# Altium schematic sheet iNixie-Kit.schdoc
size 708 x 327 mm; Name: A_A3; Symbol: A_A3; Device: A_A3; @Project Name: Action时钟_bak; REV: 1.0; Date: 2022-06-21; Sheet: 1/1; Draw By: Sadudu; Company: Your Company; Convert to PCB: yes; Add into BOM: yes
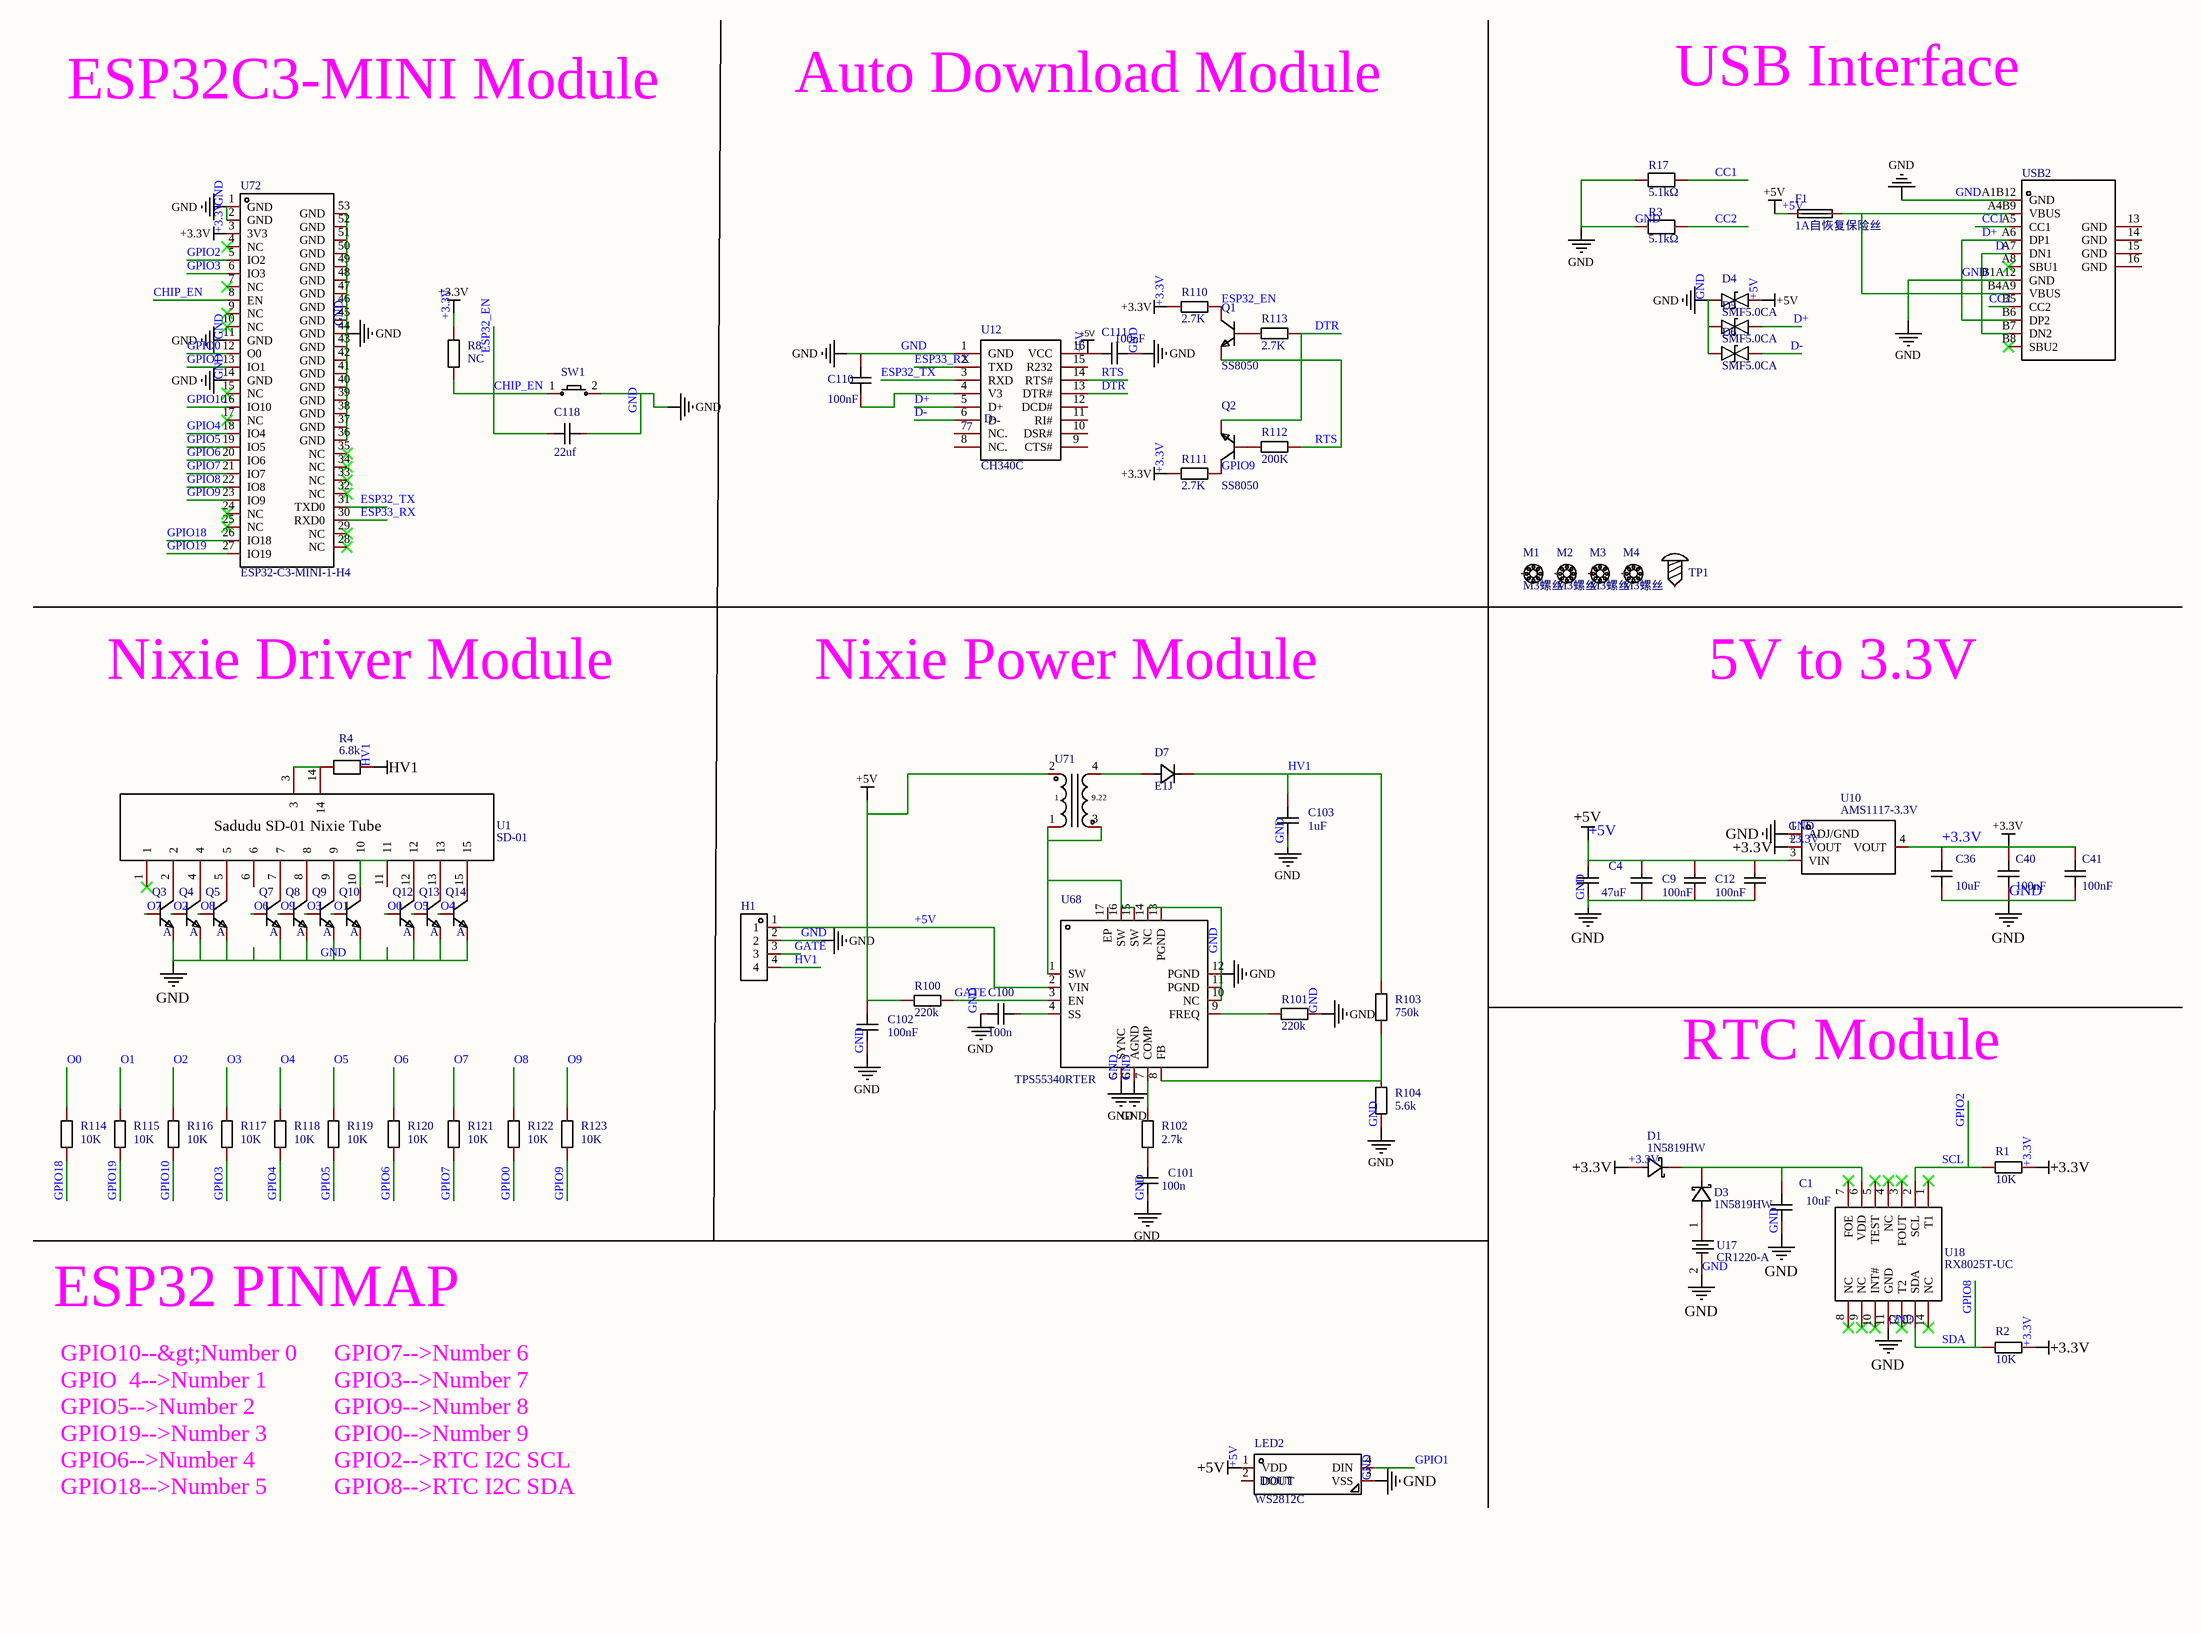
[diagram p0: iNixie-Kit.schdoc]

## Parts
C1  value 10uF  [C0603]  (hidden comment: CL10A106MP8NNNC)
C4  47uF  [C1206]
C9  value 100nF  [C0603]  (hidden comment: 0603B104K500NT)
C12  value 100nF  [C0603]  (hidden comment: 0603B104K500NT)
C13  0603B104K500NT  [C0603]  (value not drawn)
C36  value 10uF  [C0603]  (hidden comment: CL10A106MP8NNNC)
C40  100nF  [C0402]
C41  100nF  [C0402]
C100  100n  [C0402]
C101  100n  [C0402]
C102  100nF  [C0603]
C103  1uF  [C1206]
C110  100nF  [C0603]
C111  100nF  [C0603]
C118  22uf  [C0402]
D1  1N5819HW  [SOD-123_L2.7-W1.6-LS3.7-RD-1]
D3  1N5819HW  [SOD-123_L2.7-W1.6-LS3.7-RD-1]
D4  SMF5.0CA  [SOD-123_L2.8-W1.8-LS3.7-BI]
D5  SMF5.0CA  [SOD-123_L2.8-W1.8-LS3.7-BI]
D6  SMF5.0CA  [SOD-123_L2.8-W1.8-LS3.7-BI]
D7  E1J  [SOD-123FL_L2.7-W1.8-LS3.7-RD]
F1  1A自恢复保险丝  [F1812]
H1  HDR-M_2.54_1x4P  [HDR-TH_4P-P2.54-V-M]  (value not drawn)
LED2  NAME: DOUT  [LED-SMD_4P-L5.0-W5.0-LS5.4-TL-1]  (hidden comment: WS2812C)
M1  M3螺丝  [螺钉孔]
M2  M3螺丝  [螺钉孔]
M3  M3螺丝  [螺钉孔]
M4  M3螺丝  [螺钉孔]
Q1  SS8050  [SOT-23-3_L2.9-W1.3-P1.90-LS2.4-BR]
Q2  SS8050  [SOT-23-3_L2.9-W1.3-P1.90-LS2.4-BR]
Q3  A  [SOT-23-3_L2.9-W1.6-P1.90-LS2.8-TR-CW]
Q4  A  [SOT-23-3_L2.9-W1.6-P1.90-LS2.8-TR-CW]
Q5  A  [SOT-23-3_L2.9-W1.6-P1.90-LS2.8-TR-CW]
Q7  A  [SOT-23-3_L2.9-W1.6-P1.90-LS2.8-TR-CW]
Q8  A  [SOT-23-3_L2.9-W1.6-P1.90-LS2.8-TR-CW]
Q9  A  [SOT-23-3_L2.9-W1.6-P1.90-LS2.8-TR-CW]
Q10  A  [SOT-23-3_L2.9-W1.6-P1.90-LS2.8-TR-CW]
Q12  A  [SOT-23-3_L2.9-W1.6-P1.90-LS2.8-TR-CW]
Q13  A  [SOT-23-3_L2.9-W1.6-P1.90-LS2.8-TR-CW]
Q14  A  [SOT-23-3_L2.9-W1.6-P1.90-LS2.8-TR-CW]
R1  10K  [R0402]
R2  10K  [R0402]
R3  value 5.1kΩ  [R0603]  (hidden comment: td03g5101bt)
R4  6.8k  [R1206]
R8  NC  [R0402]
R17  value 5.1kΩ  [R0603]  (hidden comment: td03g5101bt)
R100  220k  [R0402]
R101  220k  [R0402]
R102  2.7k  [R0402]
R103  750k  [R0402]
R104  5.6k  [R0402]
R110  2.7K  [R0402]
R111  2.7K  [R0402]
R112  200K  [R0402]
R113  2.7K  [R0402]
R114  10K  [R0402]
R115  10K  [R0402]
R116  10K  [R0402]
R117  10K  [R0402]
R118  10K  [R0402]
R119  10K  [R0402]
R120  10K  [R0402]
R121  10K  [R0402]
R122  10K  [R0402]
R123  10K  [R0402]
SW1  Key_SMD_3.6x6.1x2.5  [Key_SMD_3.6x6.1x2.5]  (value not drawn)
TP1  M2螺丝  [M2螺丝]  (value not drawn)
U1  SD-01  [SD-01]
U10  AMS1117-3.3V  [SOT-223-4_L6.5-W3.5-P2.30-LS7.0-BR]
U12  NAME: D-  NUMBER: 7  [SOP-16_L10.0-W3.9-P1.27-LS6.0-BL]  (hidden comment: CH340C)
U17  CR1220-A  [BAT-SMD_CR1220-2]
U18  RX8025T-UC  [SOIC-14_L10.1-W5.0-P1.27-LS7.4-BL]
U68  TPS55340RTER  [VQFN-16_L3.0-W3.0-P0.50-BL-EP1.7]
U71  T3  [T3]  (value not drawn)
U72  ESP32-C3-MINI-1-H4  [WIFIM-SMD_ESP32-C3-MINI-1]
USB2  typec-304-bcp16  [USB-C-SMD_TYPEC-304-BCP16]  (value not drawn)

## Nets
+3.3V: C36.2 C40.2 C41.2 D1.2(A) R1.2 R2.2 R8.2 R110.1 R111.1 U10.2(VOUT) U10.4(VOUT) U72.3(3V3)
+5V: C4.2 C9.1 C12.1 C13.1 C102.2 C111.2 D4.1 F1.1 H1.1 LED2.1(VDD) R100.1 U10.3(VIN) U12.16(VCC) U68.2(VIN) U71.2
D+: C1.1 C4.1 C9.2 C12.2 C13.2 C36.1 C40.1 C41.1 C100.1 C101.1 C102.1 C103.1 C110.2 C111.1 C118.1 D4.2 D5.1 D5.2 D6.2 H1.2 LED2.3(VSS) Q3.1(E) Q4.1(E) Q5.1(E) Q7.1(E) Q8.1(E) Q9.1(E) Q10.1(E) Q12.1(E) Q13.1(E) Q14.1(E) R3.1 R17.1 R101.2 R104.1 SW1.2 U10.1(ADJ/GND) U12.1(GND) U12.5(D+) U17.2 U18.11(GND) U68.5(SYNC) U68.6(AGND) U68.10(NC) U68.11(PGND) U68.12(PGND) U68.13(PGND) U68.14(NC) U72.1(GND) U72.2(GND) U72.11(GND) U72.14(GND) U72.36(GND) U72.37(GND) U72.38(GND) U72.39(GND) U72.40(GND) U72.41(GND) U72.42(GND) U72.43(GND) U72.44(GND) U72.45(GND) U72.46(GND) U72.47(GND) U72.48(GND) U72.49(GND) U72.50(GND) U72.51(GND) U72.52(GND) U72.53(GND) USB2.A1B12(GND) USB2.A6(DP1) USB2.B1A12(GND) USB2.B6(DP2)  [also labelled GND]
HV1: C103.2 D7.1(K) H1.4 R4.2 R103.2
CC1: R17.2 USB2.A5(CC1)
CC2: R3.2 USB2.B5(CC2)
CHIP_EN: C118.2 Q1.3(C) R8.1 R110.2 SW1.1 U72.8(EN)  [also labelled ESP32_EN]
D-: D6.1 U12.6(D-) USB2.A7(DN1) USB2.B7(DN2)
DTR: Q2.2(E) R113.2 U12.13(DTR#)
ESP32_TX: U12.3(RXD) U72.31(TXD0)
ESP33_RX: U12.2(TXD) U72.30(RXD0)
GATE: H1.3 R100.2 U68.3(EN)
GPIO0: R122.1 U72.12(O0)
GPIO1: LED2.4(DIN) U72.13(IO1)
GPIO2: R1.1 U18.2(SCL) U72.5(IO2)  [also labelled SCL]
GPIO3: R117.1 U72.6(IO3)
GPIO4: R118.1 U72.18(IO4)
GPIO5: R119.1 U72.19(IO5)
GPIO6: R120.1 U72.20(IO6)
GPIO7: R121.1 U72.21(IO7)
GPIO8: R2.1 U18.13(SDA) U72.22(IO8)  [also labelled SDA]
GPIO9: Q2.3(C) R111.2 R123.1 U72.23(IO9)
GPIO10: R116.1 U72.16(IO10)
GPIO18: R114.1 U72.26(IO18)
GPIO19: R115.1 U72.27(IO19)
O0: Q12.2(B) R114.2
O1: Q10.2(B) R115.2
O2: Q4.2(B) R116.2
O3: Q9.2(B) R117.2
O4: Q14.2(B) R118.2
O5: Q13.2(B) R119.2
O6: Q7.2(B) R120.2
O7: Q3.2(B) R121.2
O8: Q5.2(B) R122.2
O9: Q8.2(B) R123.2
RTS: Q1.2(E) R112.2 U12.14(RTS#)
NetC1_2: C1.2 D1.1(K) D3.1(K) U18.6(VDD)
NetC100_2: C100.2 U68.4(SS)
NetC101_2: C101.2 R102.1
NetC110_1: C110.1 U12.4(V3)
NetD3_2: D3.2(A) U17.1
NetD7_2: D7.2(A) U71.4
NetF1_2: F1.2 USB2.A4B9(VBUS) USB2.B4A9(VBUS)
NetQ1_1: Q1.1(B) R113.1
NetQ2_1: Q2.1(B) R112.1
NetQ3_3: Q3.3(C) U1.2
NetQ4_3: Q4.3(C) U1.4
NetQ5_3: Q5.3(C) U1.5
NetQ7_3: Q7.3(C) U1.7
NetQ8_3: Q8.3(C) U1.8
NetQ9_3: Q9.3(C) U1.9
NetQ10_3: Q10.3(C) U1.10
NetQ12_3: Q12.3(C) U1.12
NetQ13_3: Q13.3(C) U1.13
NetQ14_3: Q14.3(C) U1.15
NetR4_1: R4.1 U1.3 U1.14
NetR101_1: R101.1 U68.9(FREQ)
NetR102_2: R102.2 U68.7(COMP)
NetR103_1: R103.1 R104.2 U68.8(FB)
NetU68_1: U68.1(SW) U68.15(SW) U68.16(SW) U71.1 U71.3

Not connected (* = marked no-connect by the designer): LED2 2(DOUT); M1 1; M2 1; M3 1; M4 1; TP1 1; U1 1* 6 11; U12 7(NC.) 8(NC.) 9(CTS#) 10(DSR#) 11(RI#) 12(DCD#) 15(R232); U18 1(T1)* 3(FOUT)* 4(NC)* 5(TEST)* 7(FOE)* 8(NC)* 9(NC)* 10(INT#)* 12(T2)* 14(NC)*; U68 17(EP); U72 4(NC)* 7(NC)* 9(NC)* 10(NC)* 15(NC)* 17(NC)* 24(NC)* 25(NC)* 28(NC)* 29(NC)* 32(NC)* 33(NC)* 34(NC)* 35(NC)*; USB2 13(GND) 14(GND) 15(GND) 16(GND) A8(SBU1)* B8(SBU2)*

## Notes on the sheet
- ESP32C3-MINI Module
- Auto Download Module
- USB Interface
- Nixie Driver Module
- Nixie Power Module
- 5V to 3.3V
- RTC Module
- ESP32 PINMAP
- GPIO10--&gt;Number 0
- GPIO  4-->Number 1
- GPIO7-->Number 6
- GPIO3-->Number 7
- GPIO5-->Number 2
- GPIO19-->Number 3
- GPIO9-->Number 8
- GPIO0-->Number 9
- GPIO6-->Number 4
- GPIO18-->Number 5
- GPIO2-->RTC I2C SCL
- GPIO8-->RTC I2C SDA
- 1
- 2
- 3
- 4
- 5
- 6
- 7
- 8
- A
- B
- C
- D
- E
- TITLE:
- Action时钟_bak
- REV:
- 1.0
- Date:
- Company:
- 2022-06-21
- Your Company
- Drawn By:
- Sadudu
- Sheet:
- 1/1
- (in symbol SD-01) Sadudu SD-01 Nixie Tube
- (in symbol T3) 9.22

## Library data of the parts
C1 C36 = CL10A106MP8NNNC: 容值:10uF;精度:±20%;额定电压:10V;温度系数:X5R;; Manufacturer: SAMSUNG(三星); Add into BOM: yes; Tolerance: ±20%; Voltage Rated: 10V; Temperature Coefficient: X5R; Symbol: CL10A106MP8NNNC; Device: CL10A106MP8NNNC; LCSC Part Name: 10uF ±20% 10V; Supplier Part: C85713; Manufacturer Part: CL10A106MP8NNNC; Supplier Footprint: 0603; JLCPCB Part Class: Extended Part; Datasheet: https://atta.szlcsc.com/upload/public/pdf/source/20161027/1477535406017.pdf; Supplier: LCSC; Convert to PCB: yes
C4 = CAP_1206: 容值:100nF;精度:±10%;额定电压:50V;温度系数:X7R;; Symbol: C1210X7R475K630NT; Convert to PCB: yes; Value: 100nF; Name: 47uF; Device: CAP_1206; Add into BOM: yes; Supplier Footprint: 1206
C9 C12 = 0603B104K500NT: 容值:100nF;精度:±10%;额定电压:50V;温度系数:X7R;; Manufacturer: FH(风华); Add into BOM: yes; Tolerance: ±10%; Voltage Rated: 50V; Temperature Coefficient: X7R; Symbol: 0603B104K500NT; Device: 0603B104K500NT; LCSC Part Name: 100nF ±10% 50V; Supplier Part: C30926; Manufacturer Part: 0603B104K500NT; Supplier Footprint: 0603; JLCPCB Part Class: Extended Part; Datasheet: https://atta.szlcsc.com/upload/public/pdf/source/20170923/C30926_1506149436298988724.pdf; Supplier: LCSC; Convert to PCB: yes
C13 = 0603B104K500NT: 容值:100nF;精度:±10%;额定电压:50V;温度系数:X7R;; Manufacturer: FH(风华); Add into BOM: yes; Value: 100nF; Tolerance: ±10%; Voltage Rated: 50V; Temperature Coefficient: X7R; Symbol: 0603B104K500NT; Device: 0603B104K500NT; LCSC Part Name: 100nF ±10% 50V; Supplier Part: C30926; Manufacturer Part: 0603B104K500NT; Supplier Footprint: 0603; JLCPCB Part Class: Extended Part; Datasheet: https://atta.szlcsc.com/upload/public/pdf/source/20170923/C30926_1506149436298988724.pdf; Supplier: LCSC; Convert to PCB: yes
C40 C41 = CAP_0402: 容值:100nF;精度:±10%;额定电压:16V;温度系数:X7R;; Symbol: C1210X7R475K630NT; Convert to PCB: yes; Name: 100nF; Device: CAP_0402; Add into BOM: yes; Supplier Part: C1525; Supplier Footprint: 0402; Value: 100nF
C100 C101 = C0402: Convert to PCB: yes; 容差: 10%; Name: 100n; Symbol: C0402; Device: C0402; Add into BOM: yes; Value: 100n
C102 = CAP_0603: Symbol: CapAcitance; Convert to PCB: yes; Name: 100nF; Device: CAP_0603; Add into BOM: yes; Supplier Footprint: 0603; Value: 100nF
C103 = CL31B105KBHNNNE: 容值:1uF;精度:±10%;额定电压:50V;材质(温度系数):X7R;; Manufacturer: SAMSUNG(三星); Add into BOM: yes; Tolerance: ±10%; Voltage Rated: 50V; Temperature Coefficient: X7R; Name: 1uF; Symbol: CL31B105KBHNNNE; Device: CL31B105KBHNNNE; LCSC Part Name: 1uF ±10% 50V; Supplier Part: C1848; Manufacturer Part: CL31B105KBHNNNE; Supplier Footprint: 1206; JLCPCB Part Class: Basic Part; Datasheet: https://atta.szlcsc.com/upload/public/pdf/source/20160103/1457707700211.pdf; Supplier: LCSC; Convert to PCB: yes; Value: 1uF
C110 C111 = CAP_0603: Symbol: C1210X7R475K630NT; Convert to PCB: yes; Description: 容值:100nF;精度:±10%;额定电压:50V;温度系数:X7R;; Name: 100nF; Device: CAP_0603; Add into BOM: yes; Supplier Footprint: 0603; Value: 100nF
C118 = CAP_0402: 容值:100nF;精度:±10%;额定电压:16V;温度系数:X7R;; Symbol: C1210X7R475K630NT; Convert to PCB: yes; Value: 100nF; Name: 22uf; Device: CAP_0402; Add into BOM: yes; Supplier Part: C1525; Supplier Footprint: 0402
D1 D3 = 1N5819HW: Manufacturer: TECH PUBLIC(台舟); Convert to PCB: yes; Name: 1N5819HW; Symbol: 1N5819HW; Device: 1N5819HW; Supplier: LCSC; Supplier Part: C2905649; Manufacturer Part: 1N5819HW; JLCPCB Part Class: Extended Part; Add into BOM: yes; Origin Footprint: SOD-123_L2.7-W1.6-LS3.7-RD-1
D4-D6 = SMF5.0CA_C908214: 极性:双向;反向截止电压(Vrwm):5V;击穿电压:6.4V;反向漏电流(Ir):800uA;峰值脉冲电流(Ipp)@10/1000s:21.7A;最大钳位电压:9.2V;; Manufacturer: FUXINSEMI(富芯森美); Add into BOM: yes; Polarity: 双向; Reverse Stand-Off Voltage (Vrwm): 5V; Breakdown Voltage: 6.4V; Reverse Leakage Current (Ir): 800uA; Peak Pulse Current (Ipp)@10/1000μs: 21.7A; Maximum Clamping Voltage: 9.2V; Name: SMF5.0CA; Symbol: SMF5.0CA_C908214; Device: SMF5.0CA_C908214; LCSC Part Name: 双向 Vrwm:5V; Supplier Part: C908214; Manufacturer Part: SMF5.0CA; Supplier Footprint: SOD-123; JLCPCB Part Class: 扩展库; Datasheet: https://atta.szlcsc.com/upload/public/pdf/source/20201023/C908211_2B6F82B5D5E79B5CF282141215A9A141.pdf; Supplier: LCSC; Convert to PCB: yes
D7 = E1J: 二极管配置:-;直流反向耐压(Vr):600V;平均整流电流(Io):1A;正向压降(Vf):1.7V@1A;反向恢复时间(trr):35ns;; Manufacturer: LGE(鲁光); Symbol: E1J_C2940141; Add into BOM: yes; Reverse Voltage (Vr): 600V; Average Rectified Current (Io): 1A; Reverse Leakage Current: 5uA@600V; Reverse Recovery Time (trr): 35ns; Name: E1J; Device: E1J; LCSC Part Name: 600V 1A 35ns; Supplier Part: C2940141; Manufacturer Part: E1J; Supplier Footprint: SOD-123FL; JLCPCB Part Class: Extended Part; Datasheet: https://atta.szlcsc.com/upload/public/pdf/source/20211231/1226450B3FE7439E66FFBC955F653A9D.pdf; Supplier: LCSC; Convert to PCB: yes; Diode Configuration: -; Forward Voltage (Vf@If): 1.7V@1A; Operating Temperature: -55℃~+150℃@(Tj)
F1 = 1A自恢复保险丝: Add into BOM: yes; Name: 1A自恢复保险丝; Symbol: 1A自恢复保险丝; Device: 1A自恢复保险丝; LCSC Part Name: 1A自恢复保险丝; Supplier Part: C9900003793; Manufacturer Part: 1A自恢复保险丝; Supplier Footprint: F1812; JLCPCB Part Class: Extended Part; Datasheet: https://atta.szlcsc.comnull; Supplier: LCSC; Convert to PCB: yes
H1 = HDR-M_2.54_1x4P: Symbol: PZ254V-11-04P; Convert to PCB: yes; Device: HDR-M_2.54_1x4P; Add into BOM: yes; Supplier Part: C492403; Supplier Footprint: 插件
LED2 = WS2812C: 发光颜色:RGB三色;; Manufacturer: worldsemi; Add into BOM: yes; Emitted Color: RGB三色; Name: WS2812C; Symbol: WS2812C; Device: WS2812C; LCSC Part Name: RGB三色 （注意防潮，请查阅规格书中对应具体内容）; Supplier Part: C114587; Manufacturer Part: WS2812C; Supplier Footprint: SMD,5x5mm; JLCPCB Part Class: 扩展库; Datasheet: https://atta.szlcsc.com/upload/public/pdf/source/20171019/C114587_15083980074721044737.pdf; Supplier: LCSC; Convert to PCB: yes
M1-M4 = M3螺丝: Add into BOM: yes; Name: M3螺丝; Symbol: M3螺丝; Device: M3螺丝; Convert to PCB: yes
Q1 Q2 = SS8050_C2150: 晶体管类型:NPN;集射极击穿电压(Vceo):25V;集电极电流(Ic):1.5A;功率(Pd):300mW;集电极截止电流(Icbo):100nA;集电极-发射极饱和电压(VCE(sat)@Ic,Ib):500mV@800mA,80mA;直流电流增益(hFE@Ic,Vce):200@100mA,1V;特征频率(fT):100MHz;工作温度:+150℃@(Tj);; Manufacturer: CJ(江苏长电/长晶); Add into BOM: yes; Transistor Type: NPN; Collector-Emitter Breakdown Voltage (Vceo): 25V; Collector Current (Ic): 1.5A; Power Dissipation (Pd): 300mW; Collector Cut-Off Current (Icbo): 100nA; Transition Frequency (fT): 100MHz; NAME: E; NUMBER: 2; Name: SS8050; Symbol: SS8050_C2150; Device: SS8050_C2150; LCSC Part Name: NPN 25V 1.5A Y1 200-350; Supplier Part: C2150; Manufacturer Part: SS8050; Supplier Footprint: SOT-23(SOT-23-3); JLCPCB Part Class: 基础库; Datasheet: https://atta.szlcsc.com/upload/public/pdf/source/20140809/1457707209319.pdf; Supplier: LCSC; Convert to PCB: yes; Collector-Emitter Saturation Voltage (VCE(sat)@Ic,Ib): 500mV@800mA,80mA; DC Current Gain (hFE@Ic,Vce): 200@100mA,1V; Operating Temperature: +150℃@(Tj)
Q3-Q5 Q7-Q10 Q12-Q14 = MMBTA42G-AE3-R: Manufacturer: UTC; Convert to PCB: yes; NAME: E; NUMBER: 1; Name: A; Symbol: A; Device: MMBTA42G-AE3-R; Supplier: LCSC; Manufacturer Part: MMBTA42G-AE3-R; Supplier Part: C84881; JLCPCB Part Class: Extended Part; Add into BOM: yes; Origin Footprint: SOT-23-3_L2.9-W1.6-P1.90-LS2.8-TR-CW
R1 R2 R8 R100-R104 R110-R123 = Res_0402: Symbol: 电阻; Convert to PCB: yes; Device: Res_0402; Add into BOM: yes; Supplier Footprint: 0402
  R1 R2 R114-R123: Name: 10K; Value: 10K
  R8: Name: NC; Value: NC
  R100 R101: Name: 220k; Value: 220k
  R102: Name: 2.7k; Value: 2.7k
  R103: Name: 750k; Value: 750k
  R104: Name: 5.6k; Value: 5.6k
  R110 R111 R113: Name: 2.7K; Value: 2.7K
  R112: Name: 200K; Value: 200K
R3 R17 = td03g5101bt: 温度系数:±25ppm/℃;精度:±0.1%;功率:100mW;阻值:5.1kΩ;最大工作电压:50V;工作温度范围:-55℃~+155℃;; Manufacturer: FH(风华); Add into BOM: yes; Tolerance: ±0.1%; Power(Watts): 100mW; Overload Voltage (Max): 50V; NAME: 1; Symbol: TD03G5101BT; Device: td03g5101bt; LCSC Part Name: 5.1KΩ(5101) ±0.1% 1/10W; Supplier Part: C667001; Manufacturer Part: TD03G5101BT; Supplier Footprint: 0603; JLCPCB Part Class: Extended Part; Datasheet: https://atta.szlcsc.com/upload/public/pdf/source/20200616/C657321_2CFA27FA726BC0D0F6223AF922169515.pdf; Supplier: LCSC; Convert to PCB: yes; Temperature Coefficient: ±25ppm/℃; Operating Temperature Range: -55℃~+155℃; NUMBER: 1
R4 = 5k: Convert to PCB: yes; NAME: 1; Name: 6.8k; Symbol: 5k; Device: 5k; Add into BOM: yes; Origin Footprint: R1206; NUMBER: 1
SW1 = Key_SMD_3.6x6.1x2.5: Symbol: 轻触按键x2; Add into BOM: yes; Device: Key_SMD_3.6x6.1x2.5; Convert to PCB: yes; Supplier Footprint: SMD
TP1 = M2螺丝: Symbol: 螺丝孔; Convert to PCB: yes; Device: M2螺丝; Add into BOM: yes; Supplier Footprint: 插件
U1 = SD-01: Manufacturer: Sadudu; Convert to PCB: yes; Name: SD-01; Symbol: SD-01; Device: SD-01; Supplier: Sadudu; Add into BOM: yes; Origin Footprint: SD-01
U10 = AMS1117-3.3V: Manufacturer: WPMtek(维攀微); Convert to PCB: yes; Name: AMS1117-3.3V; Symbol: AMS1117-3.3V; Device: AMS1117-3.3V; Supplier: LCSC; Supplier Part: C2688239; Manufacturer Part: AMS1117-3.3V; JLCPCB Part Class: Extended Part; Add into BOM: yes; Origin Footprint: SOT-223-4_L6.5-W3.5-P2.30-LS7.0-BR
U12 = CH340C: 应用功能:Transceiver;接口协议:USB 2.0;数据速率:2Mbps;供电电压:3.3V；5V;; Manufacturer: WCH(南京沁恒); Add into BOM: yes; Protocol: USB 2.0; Data Rate: 2Mbps; Name: CH340C; Symbol: CH340C; Device: CH340C; LCSC Part Name: CH340C; Supplier Part: C84681; Manufacturer Part: CH340C; Supplier Footprint: SOP-16; JLCPCB Part Class: 扩展库; Datasheet: https://atta.szlcsc.com/upload/public/pdf/source/20200819/C84681_ADBED554CE321879DBD6B1D06488689C.pdf; Supplier: LCSC; Convert to PCB: yes; Applications Function: Transceiver; Supply Voltage: 3.3V；5V
U17 = CR1220-A: Manufacturer: null; Convert to PCB: yes; Name: CR1220-A; Symbol: CR1220-A; Device: CR1220-A; Supplier: LCSC; Supplier Part: C9900016718; Manufacturer Part: CR1220-A; JLCPCB Part Class: Extended Part; Add into BOM: yes; Origin Footprint: BAT-SMD_CR1220-2
U18 = RX8025T-UC: Manufacturer: EPSON; Convert to PCB: yes; Name: RX8025T-UC; Symbol: RX8025T-UC; Device: RX8025T-UC; Supplier: LCSC; Manufacturer Part: RX8025T-UC; Supplier Part: C53691; JLCPCB Part Class: Extended Part; Add into BOM: yes; Origin Footprint: SOIC-14_L10.1-W5.0-P1.27-LS7.4-BL
U68 = TPS55340RTER: 功能类型:升压型;同步整流:否;输出类型:可调;输出通道数:1;拓扑结构:升压式;输入电压:2.9V~32V;输出电压:2.9V~38V;输出电流(最大值):5.25A;开关频率:1.14MHz;工作温度:-40℃~+125℃@(TA);; Manufacturer: TI(德州仪器); Add into BOM: yes; Function: 升压型; Synchronous Rectification: 否; Output Type: 可调; Number of Outputs: 1; Topology: 升压式; Output Current (Max): 5.25A; Name: TPS55340RTER; Symbol: TPS55340RTER; Device: TPS55340RTER; LCSC Part Name: 升压型 Vin=2.9V~32V Vout=2.9V~38V 5.25A; Supplier Part: C169167; Manufacturer Part: TPS55340RTER; Supplier Footprint: WQFN-16; JLCPCB Part Class: Extended Part; Datasheet: https://atta.szlcsc.com/upload/public/pdf/source/20180111/C169167_15156386219391255515.pdf; Supplier: LCSC; Convert to PCB: yes; Input Voltage: 2.9V~32V; Output Voltage: 2.9V~38V; Switching Frequency: 1.14MHz; Operating Temperature: -40℃~+125℃@(TA)
U71 = T3: Add into BOM: yes; Symbol: T3; Device: T3; Convert to PCB: yes
U72 = ESP32-C3-MINI-1-H4_C2935306: Manufacturer: ESPRESSIF(乐鑫); Add into BOM: yes; Name: ESP32-C3-MINI-1-H4; Symbol: ESP32-C3-MINI-1-H4; Device: ESP32-C3-MINI-1-H4_C2935306; LCSC Part Name: ESP32-C3-MINI-1-H4; Supplier Part: C2935306; Manufacturer Part: ESP32-C3-MINI-1-H4; Supplier Footprint: SMD,13.2x16.6mm; JLCPCB Part Class: 扩展库; Datasheet: https://atta.szlcsc.com/upload/public/pdf/source/20220602/2F3F799AD033675D9930B69B0B580EA8.pdf; Supplier: LCSC; Convert to PCB: yes
USB2 = typec-304-bcp16: 连接器类型:Type-C;标准:USB 3.1;公母:母座;触点数量:16.0;端口数量:1;安装方式:卧贴;额定电流 - 电源:3A;工作温度范围:-25~+85;焊接温度(最大值):260;; Manufacturer: XUNPU(讯普); Add into BOM: yes; Connector Type: Type-C; Gender: 母座; Number of Contacts: 16.0; Number of Ports: 1; Mounting Sytle: 卧贴; Current Rating - Power (Max): 3A; Welding Temperature (Max): 260; Symbol: TYPEC-304-BCP16; Device: typec-304-bcp16; LCSC Part Name: TYPEC-304-BCP16; Supplier Part: C720629; Manufacturer Part: TYPEC-304-BCP16; Supplier Footprint: SMD; JLCPCB Part Class: Extended Part; Datasheet: https://atta.szlcsc.com/upload/public/pdf/source/20211022/DACD6552F639E9483017DE6DC0E61150.pdf; Supplier: LCSC; Convert to PCB: yes; Standard: USB 3.1; Operating Temperature Range: -25~+85